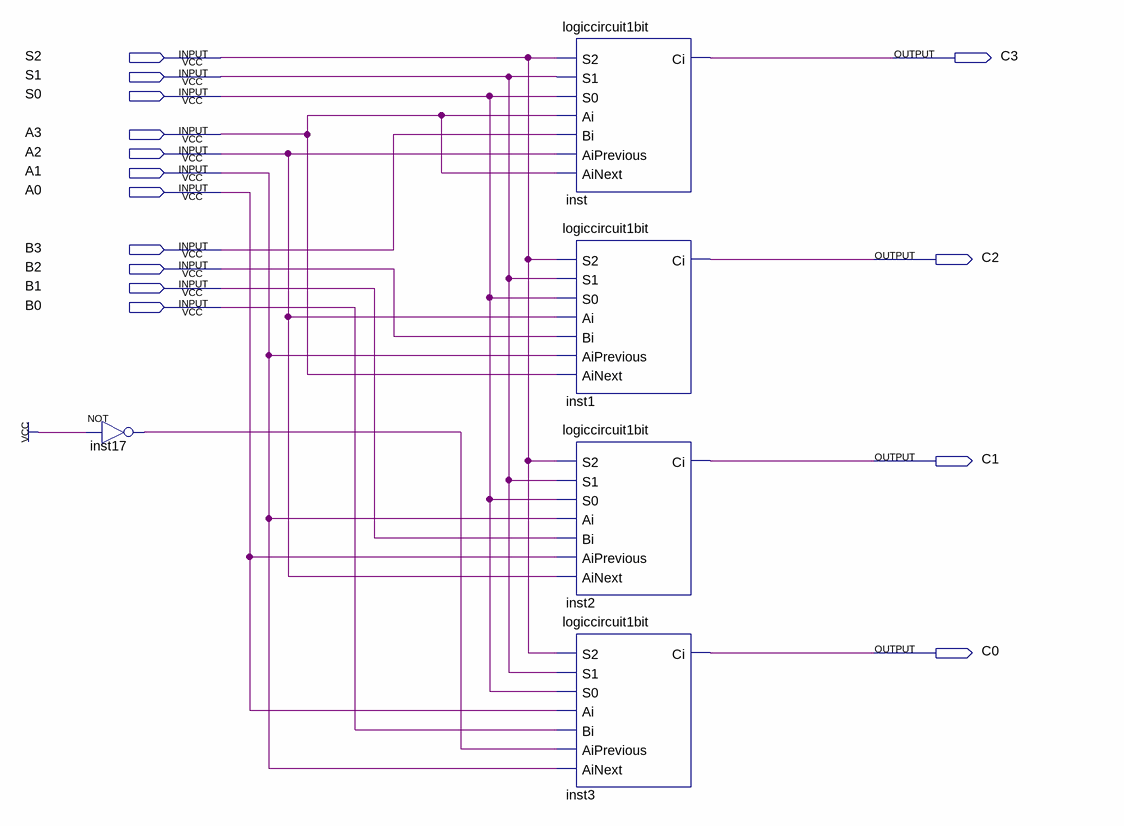
[diagram p0: schematic sheet]
// Quartus schematic logiccircuit4bit.bdf as structural Verilog: 5 symbols, 15 pins
module logiccircuit4bit (
  input  S2,
  input  S1,
  input  S0,
  input  A3,
  input  A2,
  input  A1,
  input  A0,
  input  B3,
  input  B2,
  input  B1,
  input  B0,
  output C3,
  output C2,
  output C1,
  output C0
);

  wire inst17_out;

  not inst17 (inst17_out, 1'b1);
  logiccircuit1bit inst (.S2(S2), .S1(S1), .S0(S0), .Ai(A3), .Bi(B3), .AiPrevious(A2), .AiNext(A3), .Ci(C3));
  logiccircuit1bit inst1 (.S2(S2), .S1(S1), .S0(S0), .Ai(A2), .Bi(B2), .AiPrevious(A1), .AiNext(A3), .Ci(C2));
  logiccircuit1bit inst2 (.S2(S2), .S1(S1), .S0(S0), .Ai(A1), .Bi(B1), .AiPrevious(A0), .AiNext(A2), .Ci(C1));
  logiccircuit1bit inst3 (.S2(S2), .S1(S1), .S0(S0), .Ai(A0), .Bi(B0), .AiPrevious(inst17_out), .AiNext(A1), .Ci(C0));
endmodule
